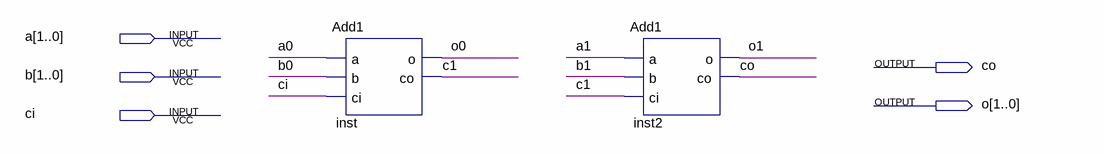
[diagram p0: schematic sheet]
// Quartus schematic ADD2.bdf as structural Verilog: 2 symbols, 5 pins
module ADD2 (
  input  [1:0] a,
  input  [1:0] b,
  input  ci,
  output co,
  output [1:0] o
);

  wire c1;

  Add1 inst (.a(a[0]), .b(b[0]), .ci(ci), .o(o[0]), .co(c1));
  Add1 inst2 (.a(a[1]), .b(b[1]), .ci(c1), .o(o[1]), .co(co));
endmodule
